# EAGLE design Adafruit 3.5 inch 480x320 Capacitive Touch Display (EAGLE 9.6.2)
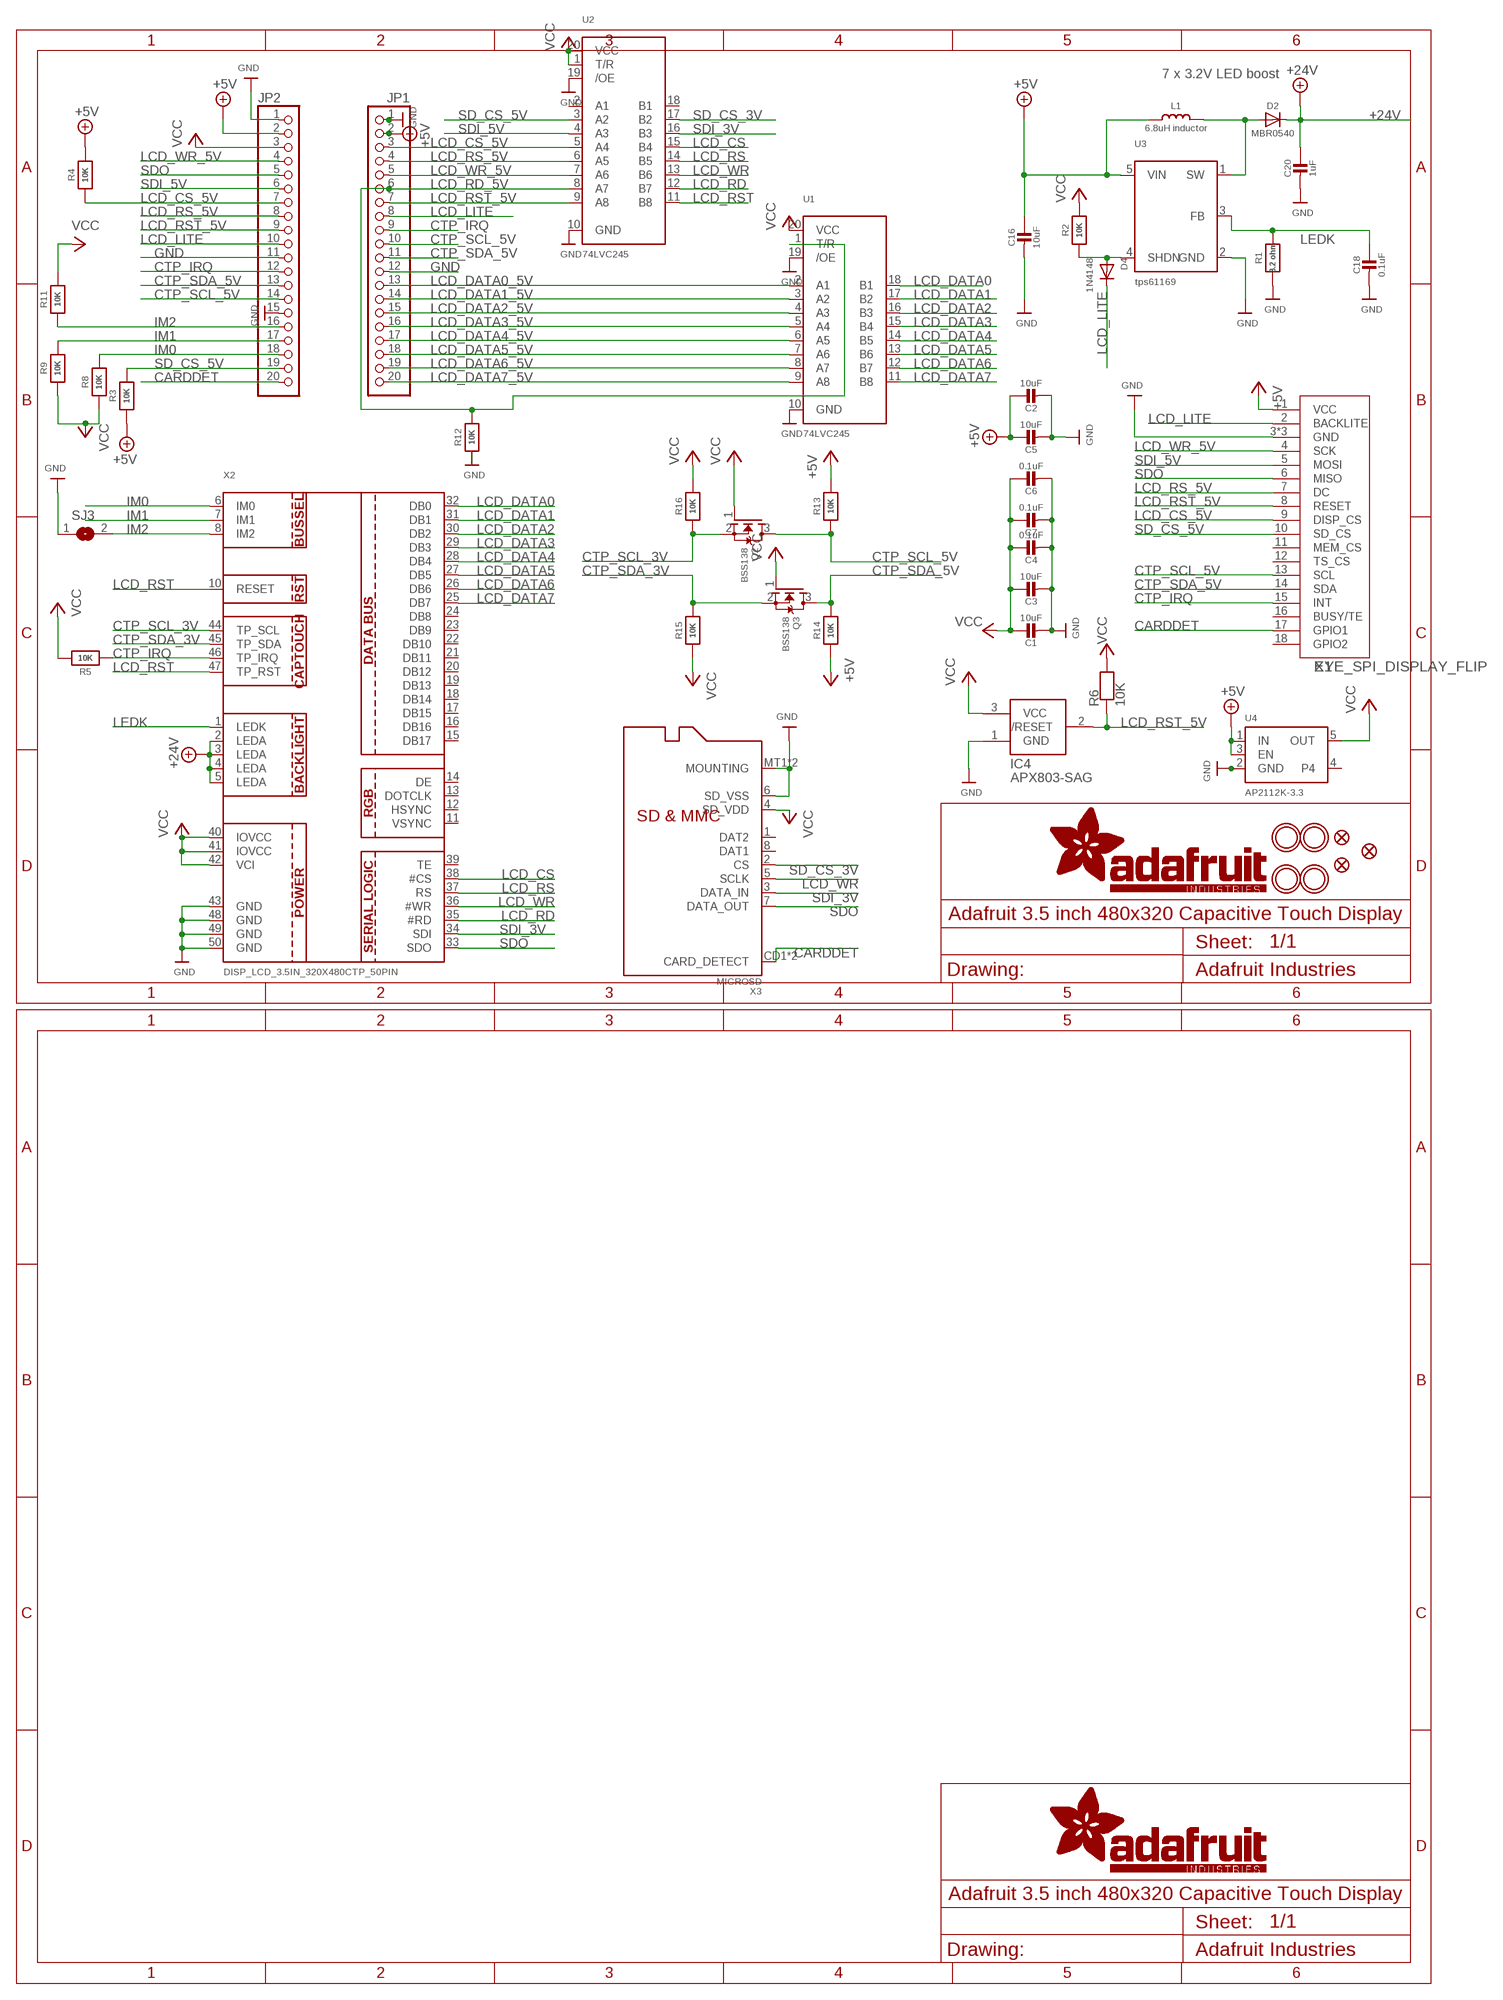
[diagram p0: schematic, sheet 1]

## Parts
C1  10uF  CAP_CERAMIC0805-NOOUTLINE  [0805-NO]
C2  10uF  CAP_CERAMIC0805-NOOUTLINE  [0805-NO]
C3  10uF  CAP_CERAMIC0805-NOOUTLINE  [0805-NO]
C4  0.1uF  CAP_CERAMIC0603_NO  [0603-NO]
C5  10uF  CAP_CERAMIC0805-NOOUTLINE  [0805-NO]
C6  0.1uF  CAP_CERAMIC0603_NO  [0603-NO]
C7  0.1uF  CAP_CERAMIC0603_NO  [0603-NO]
C16  10uF  CAP_CERAMIC0805-NOOUTLINE  [0805-NO]
C18  0.1uF  CAP_CERAMIC0603_NO  [0603-NO]
C20  1uF  CAP_CERAMIC0805-NOOUTLINE  [0805-NO]
D2  MBR0540  DIODESOD-123  [SOD-123]
D4  1N4148  DIODESOD-323F  [SOD-323F]
IC4  APX803-SAG  AXP083-SAG  [SOT23]
JP1  HEADER-1X20ROUND  [1X20_ROUND]
JP2  HEADER-1X20ROUND  [1X20_ROUND]
L1  6.8uH inductor  INDUCTORNR5040  [INDUCTOR_5X5MM_NR5040_NOTHERMALS]
Q2  BSS138  MOSFET-NWIDE  [SOT23-WIDE]
Q3  BSS138  MOSFET-NWIDE  [SOT23-WIDE]
R1  8.2 ohm  RESISTOR_0603_NOOUT  [0603-NO]
R2  10K  RESISTOR_0603_NOOUT  [0603-NO]
R3  10K  RESISTOR_0603_NOOUT  [0603-NO]
R4  10K  RESISTOR_0603_NOOUT  [0603-NO]
R5  10K  RESISTOR_0603_NOOUT  [0603-NO]
R6  10K  RESISTOR_0603_NOOUT  [0603-NO]
R8  10K  RESISTOR_0603_NOOUT  [0603-NO]
R9  10K  RESISTOR_0603_NOOUT  [0603-NO]
R11  10K  RESISTOR_0603_NOOUT  [0603-NO]
R12  10K  RESISTOR_0603_NOOUT  [0603-NO]
R13  10K  RESISTOR_0603_NOOUT  [0603-NO]
R14  10K  RESISTOR_0603_NOOUT  [0603-NO]
R15  10K  RESISTOR_0603_NOOUT  [0603-NO]
R16  10K  RESISTOR_0603_NOOUT  [0603-NO]
SJ3  SOLDERJUMPER  [SOLDERJUMPER_ARROW_NOPASTE]
U1  74LVC245  74LCX245_TSSOP20  [TSSOP20]
U2  74LVC245  74LCX245_TSSOP20  [TSSOP20]
U3  tps61169  VREG_BOOST_5PIN_SC70  [SC70-5]
U4  AP2112K-3.3  VREG_SOT23-5  [SOT23-5]
U$7  MOUNTINGHOLE3.0THIN  [MOUNTINGHOLE_3.0_PLATEDTHIN]
U$9  FIDUCIAL_1MM  [FIDUCIAL_1MM]
U$11  FIDUCIAL_1MM  [FIDUCIAL_1MM]
U$15  MOUNTINGHOLE3.0THIN  [MOUNTINGHOLE_3.0_PLATEDTHIN]
U$16  MOUNTINGHOLE3.0THIN  [MOUNTINGHOLE_3.0_PLATEDTHIN]
U$17  MOUNTINGHOLE3.0THIN  [MOUNTINGHOLE_3.0_PLATEDTHIN]
U$23  FIDUCIAL_1MM  [FIDUCIAL_1MM]
X1  EYE_SPI_DISPLAY_FLIP  [EYE_SPI_DISPLAY_BOTCONTACT]
X2  DISP_LCD_3.5IN_320X480CTP_50PIN  [TFT_3.5IN_320X480_50PIN]
X3  MICROSD  [MICROSD]

## Nets
+5V: C2.1 C5.1 C16.1 JP1.2 JP2.2 L1.P$1 R3.1 R4.2 R13.2 R14.1 U3.5(VIN) U4.1(IN) U4.3(EN) X1.1(VCC)
+24V: C20.1 D2.C X2.2(LEDA) X2.3(LEDA) X2.4(LEDA) X2.5(LEDA)
CARDDET: JP2.20 X1.17(GPIO1) X3.CD1(CARD_DETECT) X3.CD2(CARD_DETECT)
CTP_IRQ: JP1.9 JP2.12 R5.1 X1.15(INT) X2.46(TP_IRQ)
CTP_SCL_3V: Q2.2(S) R16.1 X2.44(TP_SCL)
CTP_SCL_5V: JP1.10 JP2.14 Q2.3(D) R13.1 X1.13(SCL)
CTP_SDA_3V: Q3.2(S) R15.2 X2.45(TP_SDA)
CTP_SDA_5V: JP1.11 JP2.13 Q3.3(D) R14.2 X1.14(SDA)
GND: C1.2 C2.2 C3.2 C4.2 C5.2 C6.2 C7.2 C16.2 C18.2 C20.2 IC4.1(GND) JP1.1 JP1.12 JP2.1 JP2.11 JP2.15 R1.1 R12.1 SJ3.1 U1.10(GND) U1.19(/OE) U2.10(GND) U2.19(/OE) U3.2(GND) U4.2(GND) X1.3(GND) X1.SUPPORT1(GND) X1.SUPPORT2(GND) X2.43(GND) X2.48(GND) X2.49(GND) X2.50(GND) X3.6(SD_VSS) X3.MT1(MOUNTING) X3.MT2(MOUNTING)
IM0: JP2.18 R8.2 X2.6(IM0)
IM1: JP2.17 R9.2 X2.7(IM1)
IM2: JP2.16 R11.1 SJ3.2 X2.8(IM2)
LCD_CS: U2.15(B4) X2.38(#CS)
LCD_CS_5V: JP1.3 JP2.7 R4.1 U2.5(A4) X1.9(DISP_CS)
LCD_DATA0: U1.18(B1) X2.32(DB0)
LCD_DATA0_5V: JP1.13 U1.2(A1)
LCD_DATA1: U1.17(B2) X2.31(DB1)
LCD_DATA1_5V: JP1.14 U1.3(A2)
LCD_DATA2: U1.16(B3) X2.30(DB2)
LCD_DATA2_5V: JP1.15 U1.4(A3)
LCD_DATA3: U1.15(B4) X2.29(DB3)
LCD_DATA3_5V: JP1.16 U1.5(A4)
LCD_DATA4: U1.14(B5) X2.28(DB4)
LCD_DATA4_5V: JP1.17 U1.6(A5)
LCD_DATA5: U1.13(B6) X2.27(DB5)
LCD_DATA5_5V: JP1.18 U1.7(A6)
LCD_DATA6: U1.12(B7) X2.26(DB6)
LCD_DATA6_5V: JP1.19 U1.8(A7)
LCD_DATA7: U1.11(B8) X2.25(DB7)
LCD_DATA7_5V: JP1.20 U1.9(A8)
LCD_LITE: D4.C JP1.8 JP2.10 X1.2(BACKLITE)
LCD_RD: U2.12(B7) X2.35(#RD)
LCD_RD_5V: JP1.6 R12.2 U1.1(T/R) U2.8(A7)
LCD_RS: U2.14(B5) X2.37(RS)
LCD_RS_5V: JP1.4 JP2.8 U2.6(A5) X1.7(DC)
LCD_RST: U2.11(B8) X2.10(RESET) X2.47(TP_RST)
LCD_RST_5V: IC4.2(/RESET) JP1.7 JP2.9 R6.1 U2.9(A8) X1.8(RESET)
LCD_WR: U2.13(B6) X2.36(#WR) X3.5(SCLK)
LCD_WR_5V: JP1.5 JP2.4 U2.7(A6) X1.4(SCK)
LEDK: C18.1 R1.2 U3.3(FB) X2.1(LEDK)
N$3: D2.A L1.P$2 U3.1(SW)
SD_CS_3V: U2.17(B2) X3.2(CS)
SD_CS_5V: JP2.19 R3.2 U2.3(A2) X1.10(SD_CS)
SDI_3V: U2.16(B3) X2.34(SDI) X3.3(DATA_IN)
SDI_5V: JP2.6 U2.4(A3) X1.5(MOSI)
SDO: JP2.5 X1.6(MISO) X2.33(SDO) X3.7(DATA_OUT)
SHDN: D4.A R2.1 U3.4(SHDN)
VCC: C1.1 C3.1 C4.1 C6.1 C7.1 IC4.3(VCC) JP2.3 Q2.1(G) Q3.1(G) R2.2 R5.2 R6.2 R8.1 R9.1 R11.2 R15.1 R16.2 U1.20(VCC) U2.1(T/R) U2.20(VCC) U4.5(OUT) X2.40(IOVCC) X2.41(IOVCC) X2.42(VCI) X3.4(SD_VDD)
Unconnected: U2.2(A1) U2.18(B1) U4.4 X1.11(MEM_CS) X1.12(TS_CS) X1.16(BUSY/TE) X1.18(GPIO2) X2.11(VSYNC) X2.12(HSYNC) X2.13(DOTCLK) X2.14(DE) X2.15(DB17) X2.16(DB16) X2.17(DB15) X2.18(DB14) X2.19(DB13) X2.20(DB12) X2.21(DB11) X2.22(DB10) X2.23(DB9) X2.24(DB8) X2.39(TE) X3.1(DAT2) X3.8(DAT1)

## Notes on the sheet
- 7 x 3.2V LED boost

## Library data of the parts
C1-C7 C16 C18 C20 = microbuilder:CAP_CERAMIC: Ceramic Capacitors For new designs, use the packages preceded by an '_' character since they are more reliable: The following footprints should be used on most boards: _0402 - Standard footprint for regular board layouts _0603 - Standard footprint for regular board layouts _0805 - Standard footprint for regular board layouts _1206 - Standard footprint for regular board layouts For extremely tight-pitch boards where space is at a premium, the following 'micro-pitch' footprints can be used (smaller pads, no silkscreen outline, etc.): _0402MP - Micro-pitch footprint for very dense/compact boards _0603MP - Micro-pitch footprint for very dense/compact boards _0805MP - Micro-pitch footprint for very dense/compact boards _1206MP - Micro-pitch footprint for very dense/compact boards
D2 = microbuilder:DIODE: Diode
D4 = adafruit:DIODE: Diode
IC4 = adafruit:AXP083
JP1 JP2 = microbuilder:HEADER-1X20
L1 = microbuilder:INDUCTOR: Inductors 0603: 10nH Ceramic Inductor - microwire antenna/RF (Digikey: 712-1434-2-ND) 0805: 560nH Ceramic Inductor - RF (Digikey: 553-1047-1-ND) 270nH Ceramic Inductor - Q = 40@250MHz, +-5%, 1 Ohm DC Resistance (Digikey: 535-10506-2-ND) 1007 (2518 Metric) SMT: 10µH 10% 250mOhm 820mA 1007 Inductor (Digikey: 587-2189-1-ND) 22µH 10% 500mOhm 580mA 1007 Inductor (Digikey: 587-2190-1-ND) 47µH 10% 950mOhm 420mA 1007 Inductor (Digikey: 587-2191-1-ND) 47µH 5% 100mOhm 1A 1008 Inductor (Digikey: 732-1816-1-ND) 5.0x5.0mm (Taiyo Yuden NR5040 Series) 6.8µH 20% 2.3A 64mOhm Inductor (Digikey: 587-2374-2-ND) 5.0x5.0mm (TDK VLC5045 Series) 4.7µH 20% 3.3A 34mOhm Inductor (Digikey: 445-6526-1-ND) 6.8µH 20% 2.7A 46mOhm Inductor (Digikey: 445-6527-1-ND) 6.0x6.0mm (TDK VLC6045 Series) 4.7µH 20% 3.8A 27mOhm Inductor (Digikey: 445-6538-2-ND) 6.8µH 20% 3A 41mOhm Inductor (Digikey: 445-6540-1-ND) 6.2µH 30% 2.2A 45mOhm Inductor (Digikey: SRR5028-6R2YCT-ND) - Not TDK VLC6045 but footprint should match 6.0x6.0mm (TDK SLF6045 Series) 6.8uH 30% 2A 33mOhm Inductor (Digikey: 445-4572-1-ND, Mouser: 810-SLF645T6R8N2R0PF) 6.0x6.0mm (Sumida CDRH5D28 Series) 6.2uH 30% 1.8A 45mOhm Inductor (Digikey: 308-1542-1-ND) Taiyo Yuden NR3015T2R2M - 2.2uH 20% 1.5A (Digikey: 587-1648-2-ND, Mouser: 963-NR3015T2R2M) - Used with TI TPS62172 CoilCraft RFID Transponder Coil - MA5532-AE (For use with AS3935 Lightning Sensor) Taiyo Yuden NRH2412T2R2MNGH - 2.2uH 20% 1AA (Digikey: 587-3443-1-ND) - Used with TI LM3671 Vishay IHLP 1.0uH Molded Inductor - 24mOhm DCR, 5A, +/-20%, -55°C-125°C (Digikey: 541-1319-1-ND)
Q2 Q3 = microbuilder:MOSFET-N: N-Channel Mosfet LEGEND VDS: Voltage Drain-Source ID: Drain Current RDS(ON): Drain-Source On-State Resistance VGS(TH): Gate-Source Threshold Voltage CISS: Drain-Source Input Capacitance SOT-23 Name VDS ID RDS(ON) VGS(TH) CISS Order Number 2N7002E 60V 260mA 2.5 Ohm 2.5V @ 250uA 26.7pF @ 25V 2N7002ET1GOSTR-ND BSH103 30V 850mA 400 mOhm 400mV @ 1mA 83pF @ 24V BSH103,235-ND BSS138 60V 320mA 1.6 Ohm 1.5V @ 250uA 50pF @ 10V Mouser: 771-BSS138PW115 DMN2075U-7 20V 4.2A 38 mOhm 1V @ 250 uA 594.3pF @ 10V DMN2075U-7DICT-ND * BSS138 good choice for I2C level-shifting POWERPAK 1212-8 Name VDS ID RDS(ON) VGS(TH) CISS Order Number Si7308DN 60V 6A 58 mOhm 3V @ 250uA 665pF @ 15V SI7308DN-T1-E3CT-ND
R1-R6 R8 R9 R11-R16 = microbuilder:RESISTOR: Resistors For new designs, use the packages preceded by an '_' character since they are more reliable: The following footprints should be used on most boards: _0402 - Standard footprint for regular board layouts _0603 - Standard footprint for regular board layouts _0805 - Standard footprint for regular board layouts _1206 - Standard footprint for regular board layouts For extremely tight-pitch boards where space is at a premium, the following 'micro-pitch' footprints can be used (smaller pads, no silkscreen outline, etc.): _0402MP - Micro-pitch footprint for very dense/compact boards _0603MP - Micro-pitch footprint for very dense/compact boards _0805MP - Micro-pitch footprint for very dense/compact boards _1206MP - Micro-pitch footprint for very dense/compact boards
SJ3 = microbuilder:SOLDERJUMPER: SMD Solder JUMPER Solder the two pads together to create a connection, or remove the solder to break it. REFLOW - Use this footprint for solder paste and reflow ovens. WAVE - Use this footprint for hand-soldering (larger pads). CLOSED - Has a trace between the two pads to ensure it is closed by default. The trace needs to be cut to disable the jumper, and can be closed again by creating a solder bridge between the two pads.; BOM: EXCLUDE
U1 U2 = microbuilder:74LCX245: 74LCX245MTC - 5.0V Tolerant Bi-Directional Buffer Can be used to interface 5.0V logic to 2.5 or 3.3V devices Digikey: 74LCX245MTCXTR-ND Mouser: 512-74LCX245MTCX
U3 = adafruit_power:VREG_BOOST_5PIN: FAN5331 - LED/OLED 20V Boost Converter Digikey: FAN5331SXCT-ND
U4 = adafruit_power:VREG_SOT23-5: SOT23-5 Fixed Voltage Regulators Part Current Out V Out V In V Dropout θJA (°C/W) TJ (°C) Digikey Part No. ADP121 150mA 3.3V 3.4-5.5V 0.09V @ 150mA -- -- ADP121-AUJZ33R7CT-ND ADP121 150mA 3.0V 3.1-5.5V 0.09V @ 150mA -- -- ADP121-AUJZ30R7CT-ND ADP122 300mA 3.3V 3.4-5.5V 0.085V @ 300mA -- -- ADP122AUJZ-3.3-R7CT-ND ADP1712 300mA 3.3V 3.5-5.5V 0.17V @ 300mA -- -- ADP1712AUJZ-3.3-R7TR-ND AP7311 (Low Cost) 150mA 3.3V 3.5-6V 0.15V @ 150mA -- -- AP7311-33WG-7DICT-ND LD39015M18R 150mA 1.8V 1.9V-5.5V 0.08V @ 100mA -- -- 497-6977-1-ND LP2985A-33DBVR 150mA 3.3V 3.3-16V 0.28V @ 150mA 206 150 296-18479-1-ND MCP1824T-3302E/OT 300mA 3.3V 3.5V-6V 0.2V @ 300mA -- -- MCP1824T-3302E/OTCT-ND MIC5205-2.5YM5 TR 150mA 2.5V 2.7-16V 0.165V @ 150mA -- -- 576-1257-2-ND MIC5205-3.0YM5 TR 150mA 3.0V 3.2V-16V 0.165V @ 150mA -- -- 576-1258-2-ND MIC5205-3.3YM5 TR 150mA 3.3V 3.5V-16V 0.165V @ 150mA -- -- 576-1259-2-ND TPS780330220 150mA 3.3V+2.2V 3.6-5.5V 250mV Max -- -- 296-23332-1-ND TDA3663/N1,135 100mA 3.3V 3.5-45V 0.18V @ 50mA -- -- 568-5343-1-ND Max operating temp can be calculated using θJA, TJ (max junction temperature), and power in watts. Set the "Maximum Ambient Temperature" until it reaches TJ ("Max Junction Temperature"), which is the absolute limit for safe use of the regulator: Heat Sink Temperature Calculator <http://www.daycounter.com/Calculators/Heat-Sink-Temperature-Calculator.phtml> For example, With 12V source into a 3.3V LP2985 and a 30mA load, we are dissipating (12V-3.3V) * 0.03A = 0.261W. With a θJA of 206 °C/W, a TJ of 150°C, and 261mW we can safely use the chip without a heat sink up to 75°C (=147.1°C Junction Temperature).; JLC_ROTATION: 270
U$7 U$15-U$17 = adafruit_electromech:MOUNTINGHOLE: Mounting Hole For #2 screws (0.086"/2.18mm width, 0.094"/2.4mm hole) use 2.5mm; BOM: EXCLUDE
U$9 U$11 U$23 = microbuilder:FIDUCIAL: Fiducial Alignment Points Various fiducial points for machine vision alignment.; BOM: EXCLUDE
X1 = adafruit_display:EYE_SPI_DISPLAY; LCSC: C2856802
X2 = adafruit_display:DISP_LCD_3.5IN_320X480CTP_50PIN
X3 = adafruit_electromech:MICROSD: MicroSD/Transflash Card Holder with SPI pinout 3M: 2908-05WB-MG 4UConnector: 19656 Footprint courtesy: Adafruit Industries; JLC_ROTATION: 90; LCSC: C125617

## Board
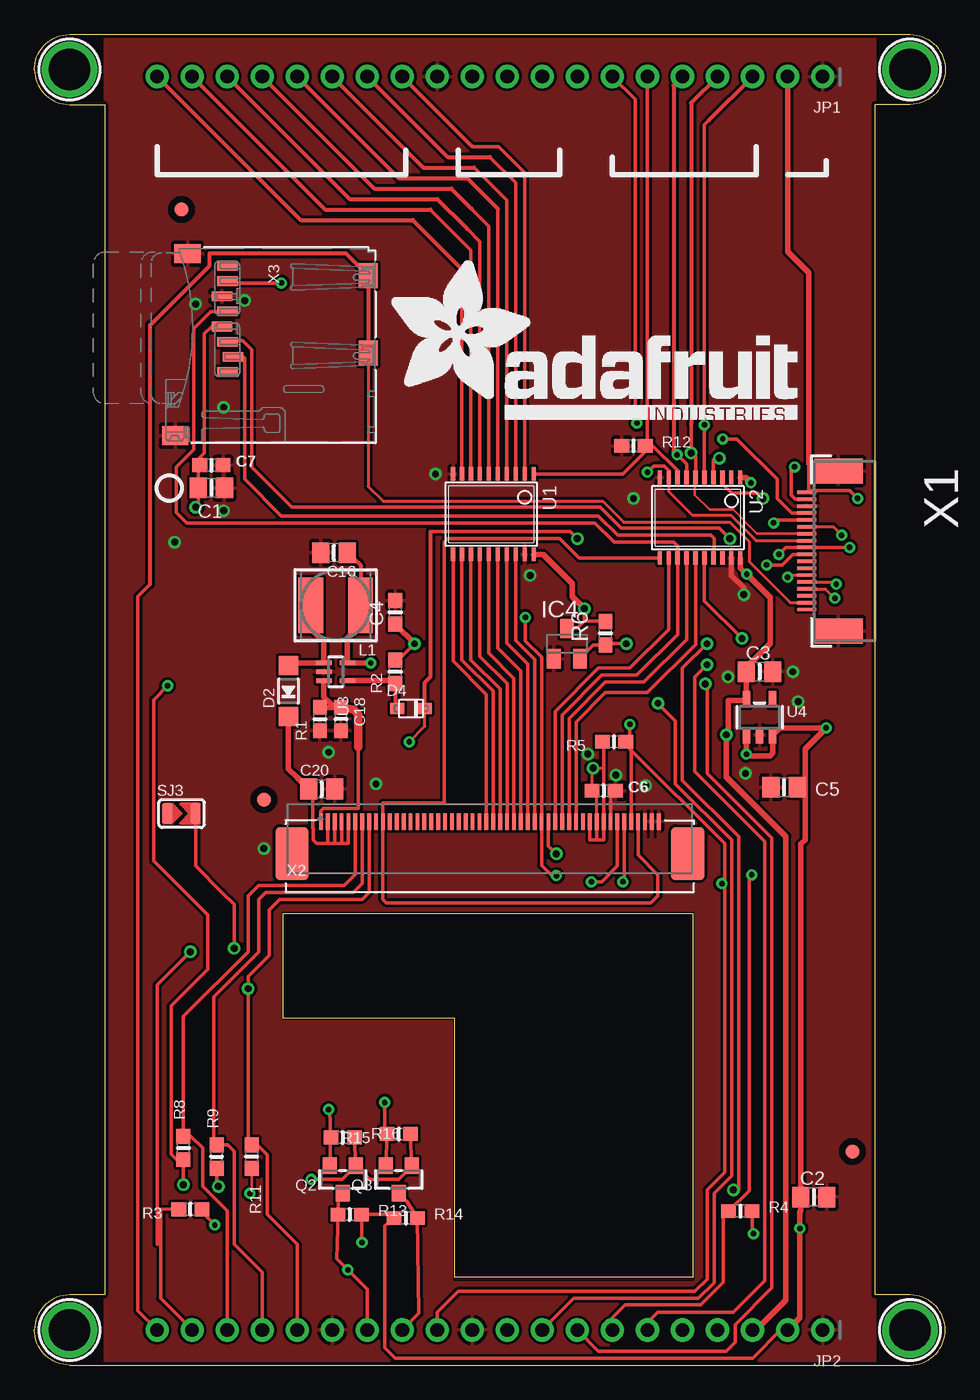
[diagram p1: board, top side]
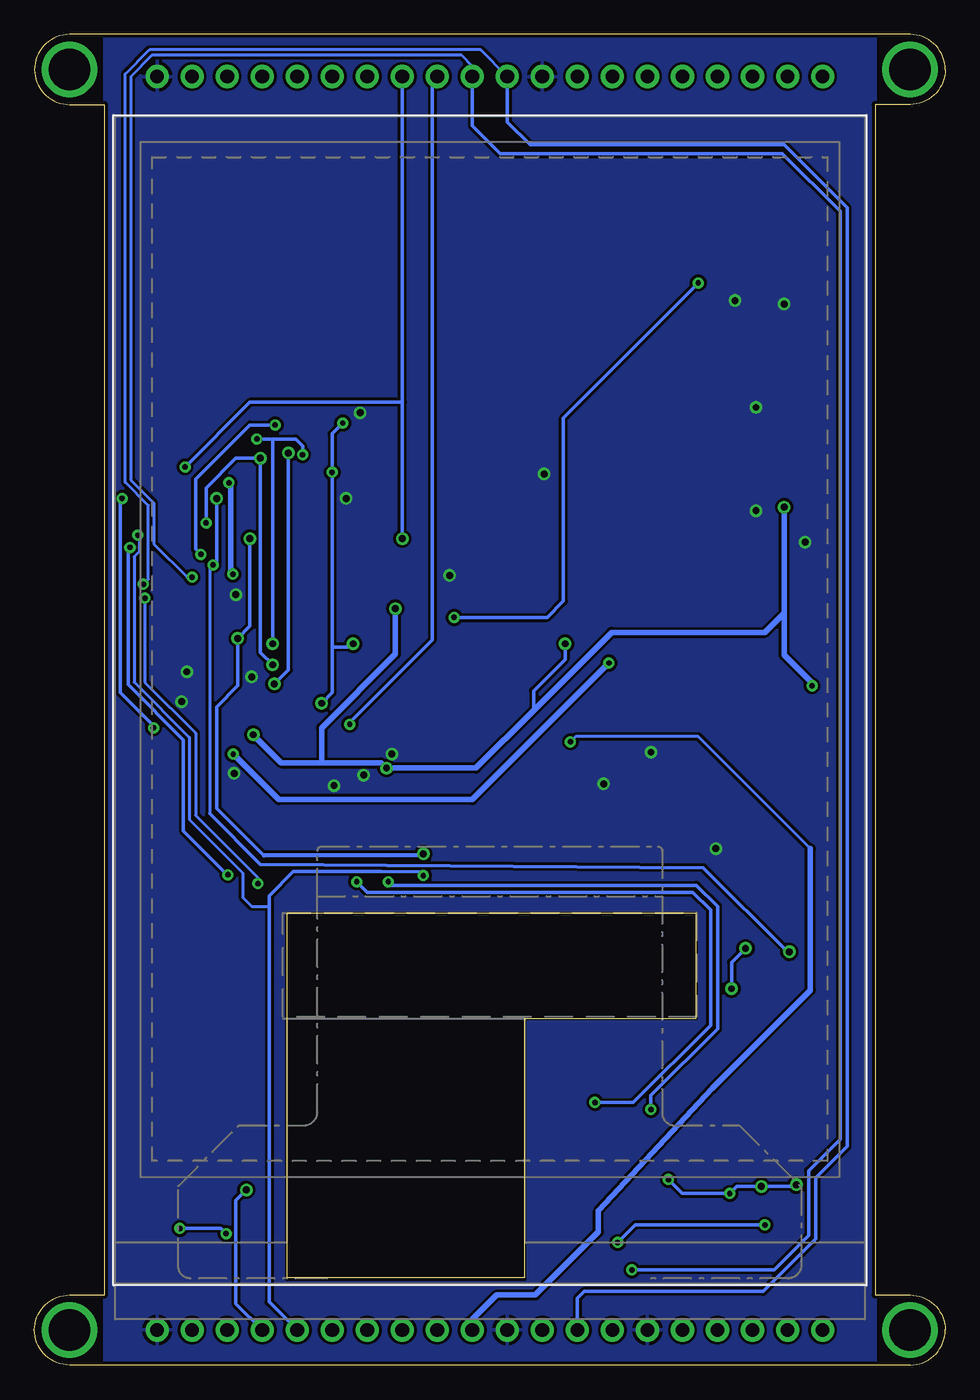
[diagram p2: board, bottom side, seen from below]

Size 66.04 x 96.52 mm. Coordinates in mm from the lower left corner, seen from the top.
Outline: 2.54,0 63.5,0 arc90 66.04,2.54 arc90 63.5,5.08 60.96,5.08 60.96,91.44 63.5,91.44 arc90 66.04,93.98 arc90 63.5,96.52 2.54,96.52 arc90 0,93.98 arc90 2.54,91.44 5.08,91.44 5.08,5.08 2.54,5.08 arc90 0,2.54 arc90 2.54,0
Copper layers (1*16): Top 0.035mm / dielectric 1.5mm / Bottom 0.035mm
Design rules "adafruit 7-7": minimum track width 7mil, minimum drill 15.5mil, track to track 8mil, track to pad 7mil, pad to pad 7mil, via to via 7mil, smd to smd 7mil, copper to edge 10mil, drill to drill 8mil, minimum pad ring 10mil, minimum via ring 8mil, stop-mask expansion 2mil, vias tented up to drill 20mil, thermal gap 10mil
tRestrict: area 44.5,38.2 to 44.6,38.6; area 45,38.2 to 45.1,38.6; area 18,6.2 to 47.8,32.8
bRestrict: area 18,6.2 to 47.8,32.8
Milling: 6 lines

### Footprints (pad centres in the part's own frame; a part is rotated, then mirrored left to right if it is on the bottom)
0805-NO = smd 1.24 x 1.5: 1 -0.95,0; 2 0.95,0
0603-NO = smd 1.075 x 1: 1 -0.85,0; 2 0.85,0
SOD-123 = smd 1.4 x 1.4: A 1.85,0; C -1.85,0
SOD-323F = smd 1 x 0.8: A -1,0; C 1,0
SOT23 = smd 1 x 1.4: 1 -0.95,-1.1; 2 0.95,-1.1; 3 0,1.1
1X20_ROUND = drill 1 pad 1.676: 1 -24.13,0; 2 -21.59,0; 3 -19.05,0; 4 -16.51,0; 5 -13.97,0; 6 -11.43,0; 7 -8.89,0; 8 -6.35,0; 9 -3.81,0; 10 -1.27,0; 11 1.27,0; 12 3.81,0; 13 6.35,0; 14 8.89,0; 15 11.43,0; 16 13.97,0; 17 16.51,0; 18 19.05,0; 19 21.59,0; 20 24.13,0
INDUCTOR_5X5MM_NR5040_NOTHERMALS = smd 1.8 x 4: P$1 -1.8,0; P$2 1.8,0
SOT23-WIDE = smd 1 x 1.2: 1 -0.95,-1; 2 0.95,-1; 3 0,1
SOLDERJUMPER_ARROW_NOPASTE = smd 0.762 x 1.524: 1 -1.016,0; 2 1.016,0
TSSOP20 = smd 0.305 x 0.991: 1 -2.925,-2.918; 2 -2.275,-2.918; 3 -1.625,-2.918; 4 -0.975,-2.918; 5 -0.325,-2.918; 6 0.325,-2.918; 7 0.975,-2.918; 8 1.625,-2.918; 9 2.275,-2.918; 10 2.925,-2.918; 11 2.925,2.918; 12 2.275,2.918; 13 1.625,2.918; 14 0.975,2.918; 15 0.325,2.918; 16 -0.325,2.918; 17 -0.975,2.918; 18 -1.625,2.918; 19 -2.275,2.918; 20 -2.925,2.918
SC70-5 = smd 0.35 x 1.15: 1 -0.65,-0.85; 2 0,-0.85; 3 0.65,-0.85; 4 0.65,0.85; 5 -0.65,0.85
SOT23-5 = smd 0.55 x 1.2: 1 -0.95,-1.3; 2 0,-1.3; 3 0.95,-1.3; 4 0.95,1.3; 5 -0.95,1.3
MOUNTINGHOLE_3.0_PLATEDTHIN = drill 3 pad 3.6: P$1 0,0
FIDUCIAL_1MM = smd 1 x 1: 1 0,0
EYE_SPI_DISPLAY_BOTCONTACT = smd 0.25 x 1.4: 1 4.25,1.154; 2 3.75,1.154; 3 3.25,1.154; 4 2.75,1.154; 5 2.25,1.154; 6 1.75,1.154; 7 1.25,1.154; 8 0.75,1.154; 9 0.25,1.154; 10 -0.25,1.154; 11 -0.75,1.154; 12 -1.25,1.154; 13 -1.75,1.154; 14 -2.25,1.154; 15 -2.75,1.154; 16 -3.25,1.154; 17 -3.75,1.154; 18 -4.25,1.154 | smd 1.8 x 3.5: SUPPORT1 -5.8,-1.152; SUPPORT2 5.8,-1.152
TFT_3.5IN_320X480_50PIN = smd 0.275 x 1.2 bottom: 1 12.25,1.066; 2 11.75,1.066; 3 11.25,1.066; 4 10.75,1.066; 5 10.25,1.066; 6 9.75,1.066; 7 9.25,1.066; 8 8.75,1.066; 9 8.25,1.066; 10 7.75,1.066; 11 7.25,1.066; 12 6.75,1.066; 13 6.25,1.066; 14 5.75,1.066; 15 5.25,1.066; 16 4.75,1.066; 17 4.25,1.066; 18 3.75,1.066; 19 3.25,1.066; 20 2.75,1.066; 21 2.25,1.066; 22 1.75,1.066; 23 1.25,1.066; 24 0.75,1.066; 25 0.25,1.066; 26 -0.25,1.066; 27 -0.75,1.066; 28 -1.25,1.066; 29 -1.75,1.066; 30 -2.25,1.066; 31 -2.75,1.066; 32 -3.25,1.066; 33 -3.75,1.066; 34 -4.25,1.066; 35 -4.75,1.066; 36 -5.25,1.066; 37 -5.75,1.066; 38 -6.25,1.066; 39 -6.75,1.066; 40 -7.25,1.066; 41 -7.75,1.066; 42 -8.25,1.066; 43 -8.75,1.066; 44 -9.25,1.066; 45 -9.75,1.066; 46 -10.25,1.066; 47 -10.75,1.066; 48 -11.25,1.066; 49 -11.75,1.066; 50 -12.25,1.066 | smd 2.4 x 3.81 bottom: PAD1 14.35,-1.253; PAD2 -14.35,-1.253
MICROSD = smd 0.7 x 1.5: 1 1.761,-3.147; 2 0.661,-2.747; 3 -0.439,-3.147; 4 -1.539,-3.547; 5 -2.639,-3.147; 6 -3.739,-3.547; 7 -4.839,-3.147; 8 -5.939,-3.147 | smd 1.8 x 1.4: CD1 -5.239,7.053; CD2 0.38,7.053 | smd 1.4 x 1.9: MT1 -6.839,-6.047; MT2 6.361,-6.947

### Placement (x,y rotation side)
C1  12.83,63.63 0 top
C2  56.52,12.19 0 top
C3  52.58,50.29 0 top
C4  26.16,54.61 90 top
C5  54.36,41.91 180 top
C6  41.28,41.66 0 top
C7  12.83,65.28 0 top
C16  21.72,58.93 180 top
C18  22.23,46.86 270 top
C20  20.83,41.78 0 top
D2  18.42,48.89 90 top
D4  27.31,47.62 0 top
IC4  38.61,52.32 0 top
JP1  33.02,93.47 180 top
JP2  33.02,2.54 180 top
L1  21.84,55.12 180 top
PLABEL0  [PLABEL0]  6.35,34.16 90 top
PLABEL1  [PLABEL1]  19.18,23.5 0 top
PLABEL2  [PLABEL2]  18.8,20.45 0 top
PLABEL3  [PLABEL3]  44.83,78.1 0 top
PLABEL4  [PLABEL4]  9.4,90.17 90 top
PLABEL5  [PLABEL5]  11.94,90.17 90 top
PLABEL6  [PLABEL6]  14.48,90.17 90 top
PLABEL7  [PLABEL7]  17.02,90.17 90 top
PLABEL8  [PLABEL8]  19.56,90.17 90 top
PLABEL9  [PLABEL9]  22.1,90.17 90 top
PLABEL10  [PLABEL10]  24.64,90.17 90 top
PLABEL11  [PLABEL11]  27.18,90.17 90 top
PLABEL12  [PLABEL12]  29.72,88.39 90 top
PLABEL13  [PLABEL13]  34.29,88.9 90 top
PLABEL14  [PLABEL14]  34.93,89.28 90 top
PLABEL15  [PLABEL15]  37.47,89.28 90 top
PLABEL16  [PLABEL16]  39.88,86.11 90 top
PLABEL17  [PLABEL17]  42.55,89.41 90 top
PLABEL18  [PLABEL18]  45.09,89.92 90 top
PLABEL19  [PLABEL19]  47.62,89.66 90 top
PLABEL20  [PLABEL20]  50.17,89.15 90 top
PLABEL21  [PLABEL21]  52.7,90.17 90 top
PLABEL22  [PLABEL22]  55.25,88.52 90 top
PLABEL23  [PLABEL23]  57.79,88.39 90 top
PLABEL24  [PLABEL24]  44.96,80.26 0 top
PLABEL25  [PLABEL25]  32.51,84.96 0 top
PLABEL26  [PLABEL26]  47.24,85.09 0 top
PLABEL27  [PLABEL27]  56.26,84.58 0 top
PLABEL28  [PLABEL28]  47.12,83.06 0 top
PLABEL29  [PLABEL29]  18.8,84.71 0 top
PLABEL30  [PLABEL30]  9.4,3.81 90 top
PLABEL31  [PLABEL31]  11.94,3.81 90 top
PLABEL32  [PLABEL32]  14.48,3.81 90 top
PLABEL33  [PLABEL33]  17.02,3.81 90 top
PLABEL34  [PLABEL34]  19.56,3.81 90 top
PLABEL35  [PLABEL35]  22.1,3.81 90 top
PLABEL36  [PLABEL36]  24.64,3.81 90 top
PLABEL37  [PLABEL37]  27.18,3.81 90 top
PLABEL38  [PLABEL38]  29.72,3.81 90 top
PLABEL39  [PLABEL39]  29.72,0.25 0 top
PLABEL40  [PLABEL40]  32.89,3.68 0 top
PLABEL41  [PLABEL41]  35.31,0.38 0 top
PLABEL42  [PLABEL42]  37.85,3.81 0 top
PLABEL43  [PLABEL43]  40.77,0.25 0 top
PLABEL44  [PLABEL44]  42.29,3.81 0 top
PLABEL45  [PLABEL45]  44.96,0.25 0 top
PLABEL46  [PLABEL46]  50.17,3.56 90 top
PLABEL47  [PLABEL47]  52.58,3.68 90 top
PLABEL48  [PLABEL48]  55.12,3.68 90 top
PLABEL49  [PLABEL49]  57.66,3.68 90 top
PLABEL50  [PLABEL50]  13.34,40.13 90 top
PLABEL51  [PLABEL51]  20.19,8.38 0 top
PLABEL52  [PLABEL52]  10.92,34.8 90 top
PLABEL53  [PLABEL53]  55.63,26.04 90 top
PLABEL54  [PLABEL54]  11.43,92.2 0 bottom
PLABEL55  [PLABEL55]  13.97,92.2 0 bottom
PLABEL56  [PLABEL56]  16.51,92.2 0 bottom
PLABEL57  [PLABEL57]  19.05,92.2 0 bottom
PLABEL58  [PLABEL58]  8.89,92.2 0 bottom
PLABEL59  [PLABEL59]  21.59,92.2 0 bottom
PLABEL60  [PLABEL60]  24.13,92.2 0 bottom
PLABEL61  [PLABEL61]  26.67,92.2 0 bottom
PLABEL62  [PLABEL62]  29.21,96.01 0 bottom
PLABEL63  [PLABEL63]  31.75,92.2 0 bottom
PLABEL64  [PLABEL64]  33.78,96.01 0 bottom
PLABEL65  [PLABEL65]  36.83,92.2 0 bottom
PLABEL66  [PLABEL66]  39.24,95.88 0 bottom
PLABEL67  [PLABEL67]  41.91,92.2 0 bottom
PLABEL68  [PLABEL68]  44.45,95.88 0 bottom
PLABEL69  [PLABEL69]  46.99,92.2 0 bottom
PLABEL70  [PLABEL70]  49.53,95.88 0 bottom
PLABEL71  [PLABEL71]  52.07,92.2 0 bottom
PLABEL72  [PLABEL72]  54.74,95.88 0 bottom
PLABEL73  [PLABEL73]  57.15,92.33 0 bottom
PLABEL74  [PLABEL74]  8.76,4.83 0 bottom
PLABEL75  [PLABEL75]  11.43,0.25 0 bottom
PLABEL76  [PLABEL76]  13.97,3.68 0 bottom
PLABEL77  [PLABEL77]  16.51,0.25 0 bottom
PLABEL78  [PLABEL78]  19.05,3.68 0 bottom
PLABEL79  [PLABEL79]  21.59,0.25 0 bottom
PLABEL80  [PLABEL80]  24.13,3.68 0 bottom
PLABEL81  [PLABEL81]  26.67,-1.78 0 bottom
PLABEL82  [PLABEL82]  29.21,3.68 0 bottom
PLABEL83  [PLABEL83]  31.75,0.25 0 bottom
PLABEL84  [PLABEL84]  34.29,3.68 0 bottom
PLABEL85  [PLABEL85]  36.83,0.25 0 bottom
PLABEL86  [PLABEL86]  39.37,3.56 0 bottom
PLABEL87  [PLABEL87]  41.91,0.25 0 bottom
PLABEL88  [PLABEL88]  44.45,3.68 0 bottom
PLABEL89  [PLABEL89]  46.99,0.25 0 bottom
PLABEL90  [PLABEL90]  49.53,3.68 0 bottom
PLABEL91  [PLABEL91]  52.07,0.25 0 bottom
PLABEL92  [PLABEL92]  54.61,3.68 0 bottom
PLABEL93  [PLABEL93]  57.15,0.25 0 bottom
Q2  22.35,13.46 180 top
Q3  26.42,13.46 180 top
R1  20.7,46.86 90 top
R2  26.16,50.29 90 top
R3  11.3,11.3 180 top
R4  51.18,11.18 0 top
R5  42.04,45.21 180 top
R6  41.4,53.09 90 top
R8  10.8,15.75 90 top
R9  13.21,15.11 90 top
R11  15.75,15.11 270 top
R12  43.43,66.67 0 top
R13  22.86,10.92 0 top
R14  26.92,10.67 0 top
R15  26.42,16.76 180 top
R16  22.35,16.51 0 top
SJ3  10.67,40.01 0 top
U1  33.27,61.72 180 top
U2  48.26,61.47 180 top
U3  21.84,50.29 270 top
U4  52.58,46.99 0 top
U$7  2.54,2.54 0 top
U$9  59.31,15.49 0 top
U$11  10.67,83.82 0 top
U$15  63.5,2.54 0 top
U$16  2.54,93.98 0 top
U$17  63.5,93.98 0 top
U$19  [ADAFRUIT_TEXT_30MM]  25.65,68.58 0 top
U$23  16.64,41.02 0 top
U$31  [PCBFEAT-REV-040]  9.78,63.63 90 top
X1  57.15,59.05 90 top
X2  33.02,38.35 0 bottom
X3  17.15,73.79 270 top

### Tracks (layer width: path | path; a pad name or v marks a point on that pad's centre or on a via)
+5V  (via drill 0.39)
  Top 0.254: JP2.2 54.1,2.54 52.07,0.51 26.16,0.51 25.4,1.27 25.4,10.09 R14.1 25.82,10.92 R13.2 23.75,10.86 v23.75,8.89 | R4.2 52.03,9.63 v52.14,9.52 | v13.07,10.16 12.15,11.08 R3.1 | v59.69,62.86 59.12,63.43 56.12,63.43 X1.1 56.13,63.44 56.13,65.41
  Top 0.305: C16.1 23.64,58.02 L1.P$1
  Top 0.406: JP1.2 54.61,80.77 56.13,79.25 56.13,65.41 | 55.88,41.91 55.88,38.1 55.57,37.78 C2.1 55.57,11.18 55.5,11.11 v55.5,9.91 55.5,3.43 JP2.2 | 55.88,41.91 55.88,44.7 v57.4,46.23 54.07,46.23 U4.3 | C5.1 55.88,41.91 | L1.P$1 23.64,53.67 22.69,52.72 U3.5 24.37,50.94 v24.38,50.93 | U4.1 v51.63,44.32 51.63,44.2 53.34,44.2 53.53,44.38 U4.3 | U4.3
  Bottom 0.254: v52.14,9.52 52.52,9.91 v55.5,9.91 | v13.07,10.16 22.48,10.16 v23.75,8.89 | v59.69,62.86 59.82,62.74 59.82,48.77 57.4,46.35 v57.4,46.23
  Bottom 0.406: v24.38,50.93 34.29,41.02 48.33,41.02 v51.63,44.32
+24V
  Top 0.254: X2.2 21.27,37.85 | X2.3 21.77,37.85 | 21.77,37.85 21.27,37.85 | X2.4 22.27,37.85 | 22.27,37.85 21.77,37.85 | X2.5 22.77,37.85 22.27,37.85 | 21.27,37.85 20.45,37.85 20.2,38.1 20.2,38.97 20.19,38.97 20.19,41.47 C20.1
  Top 0.406: C20.1 19.05,42.61 18.42,43.25 D2.C
CARDDET
  Top 0.203: X3.CD2 24.2,63.74 25.27,62.66 41.2,62.66 42.72,61.14 50.43,61.14 51.82,59.75 51.82,58.29 54.8,55.3 X1.17
  Top 0.254: JP2.20 7.49,3.94 7.49,55.75 8.38,56.64
  Top 0.305: 8.38,56.64 8.38,75.44 12.7,79.76 12.7,80.65 22.58,80.65 X3.CD1 X3.CD2
CTP_IRQ  (via drill 0.39)
  Top 0.203: X1.15 57.36,56.3 v58.04,55.63 | v49.84,34.92 50.04,35.12 50.04,35.43
  Top 0.254: X2.46 43.27,45.12 43.18,45.21 | v43.18,46.48 43.18,45.21 | 43.18,45.21 43.18,44.7 50.04,37.85 50.04,35.43 50.04,13.97 48.77,12.7 48.77,6.22 47.88,5.33 30.73,5.33 29.21,3.81 JP2.12 | R5.1 43.18,45.21
  Bottom 0.203: v58.04,55.63 58.04,49.52 54.36,45.83 54.36,39.88 49.84,35.36 v49.84,34.92
  Bottom 0.254: v43.18,46.48 43.18,46.61 37.21,52.58 37.21,93.09 JP1.9
CTP_SCL_3V  (via drill 0.39)
  Top 0.254: Q2.2 R16.1 21.4,18.48 v21.34,18.54 | v40.39,35.05 41.13,35.05 42.27,36.2 X2.44
  Bottom 0.254: v21.34,18.54 21.34,19.56 16.51,24.38 16.51,33.27 18.03,34.8 40.13,34.8 v40.39,35.05
CTP_SCL_5V  (via drill 0.39)
  Top 0.203: v54.61,57.15 54.61,57.3 X1.13
  Top 0.254: Q2.3 22.03,12.01 R13.1 21.9,7.71 v22.72,6.9 24.13,5.49 JP2.14
  Bottom 0.203: JP1.10 34.29,94.23 35.05,95 57.53,95 59.06,93.47 59.06,64.2 57.38,62.52 57.38,59.56 54.97,57.15 v54.61,57.15
  Bottom 0.254: JP1.10 34.29,89.92 32.26,87.88 11.81,87.88 7.62,83.69 7.62,16.38 9.91,14.1 9.91,9.4 12.41,6.9 v22.72,6.9
CTP_SDA_3V  (via drill 0.39)
  Top 0.254: Q3.2 R15.2 25.4,16.83 v25.4,19.05 | v42.67,35.05 42.77,35.15 X2.45
  Bottom 0.254: v25.4,19.05 22.61,19.05 17.02,24.64 17.02,33.02 18.29,34.29 41.91,34.29 v42.67,35.05
CTP_SDA_5V  (via drill 0.39)
  Top 0.203: X1.14 57.98,56.8 v58.14,56.64
  Top 0.254: Q3.3 26.99,11.89 R14.2 27.87,3.74 JP2.13
  Bottom 0.203: JP1.11 33.68,95.4 57.7,95.4 59.46,93.64 59.46,64.03 57.79,62.36 57.79,57 v58.14,56.64
  Bottom 0.254: JP1.11 31.75,90.17 30.1,88.52 11.68,88.52 7.11,83.95 7.11,15.88 9.4,13.59 9.4,9.14 13.21,5.33 26.16,5.33 26.67,4.83 JP2.13
GND  (via drill 0.5)
  Top 0.254: X2.43 41.77,41.3 C6.2
  Top 0.406: U2.19 50.54,57.29 51.44,56.39 v51.44,55.88
  other vias: 35.94,57.28 40.13,44.32 44.32,42.04 51.56,42.93 55.37,48.13 16.64,37.47 10.16,59.69 21.34,44.45 24.77,42.16 13.72,69.47 42.16,42.8 11.68,76.96 15.24,77.22 13.72,61.98 29.08,64.64 43.43,62.86 42.42,69.09 54.99,50.29 50.29,49.91
  pour Top: 5.08,96.52 5.08,0 60.96,0 60.96,96.52
  pour Bottom: 5.08,96.52 5.08,0 60.96,0 60.96,96.52
IM0
  Top 0.254: X2.6 23.27,35.59 22.48,34.8 16.26,34.8 15.49,34.04 15.49,29.97 10.8,25.27 R8.2 11.34,16.6 12.19,15.75 12.19,12.95 13.97,11.18 JP2.18
IM1
  Top 0.203: R9.2 13,16.17 13,16.27
  Top 0.254: X2.7 23.77,34.95 23.11,34.29 16.76,34.29 16.26,33.78 16.26,29.97 13,26.72 13,16.27 | R9.2 14.01,15.96 14.48,15.49 14.48,8.76 16.51,6.73 JP2.17
IM2  (via drill 0.5)
  Top 0.203: R11.1 15.49,16.22 15.49,16.32
  Top 0.254: SJ3.2 11.68,36.2 13.59,34.29 14.48,33.4 v14.48,30.23 | X2.8 24.27,34.29 23.76,33.78 17.78,33.78 17.02,33.02 17.02,29.72 15.49,28.19 v15.49,27.3 15.49,16.32 | R11.1 16.17,15.96 16.89,15.24 16.89,10.92 19.05,8.76 JP2.16
  Bottom 0.254: v14.48,30.23 15.49,29.21 v15.49,27.3
LCD_CS
  Top 0.254: X2.38 39.27,46.64 41.4,48.77 44.45,48.77 47.94,52.25 U2.15
LCD_CS_5V  (via drill 0.39)
  Top 0.254: U2.5 v48.59,68.2 48.59,89.99 48.9,90.3 | JP2.7 41.91,3.43 42.85,4.37 48.32,4.37 49.95,6 49.95,10.8 R4.1 50.35,11.18 51.82,12.64 51.82,35.36 v52.01,35.56 | v59.11,59.31 v59.11,59.3 X1.9 54.48,59.3 v53.98,58.8
  Top 0.305: 48.9,90.3 JP1.3
  Bottom 0.254: v59.11,59.31 59.11,59.08 59.25,58.94 59.25,49.36 55.25,45.35 55.25,38.73 52.07,35.56 v52.01,35.56 | v53.98,58.8 54.36,59.18 54.36,64.26 50.42,68.2 v48.59,68.2
LCD_DATA0
  Top 0.254: X2.32 36.27,51.18 34.9,52.55 U1.18
LCD_DATA0_5V
  Top 0.254: U1.2 35.55,86.5 33.66,88.39 31.75,88.39
  Top 0.305: 31.75,88.39 JP1.13
LCD_DATA1
  Top 0.254: X2.31 35.77,50.84 34.25,52.37 U1.17
LCD_DATA1_5V
  Top 0.254: U1.3 34.9,85.75 33.02,87.63
  Top 0.305: JP1.14 29.97,87.63 33.02,87.63
LCD_DATA2
  Top 0.254: X2.30 35.27,50.33 33.6,52 U1.16
LCD_DATA2_5V
  Top 0.254: 31.88,86.87 34.25,84.5 U1.4
  Top 0.305: JP1.15 28.19,86.87 31.88,86.87
LCD_DATA3
  Top 0.254: X2.29 34.77,49.81 32.95,51.63 U1.15
LCD_DATA3_5V
  Top 0.254: U1.5 33.6,83.88
  Top 0.305: JP1.16 26.42,86.11 31.37,86.11 33.6,83.88
LCD_DATA4
  Top 0.254: X2.28 34.27,49.42 32.3,51.39 U1.14
LCD_DATA4_5V
  Top 0.254: U1.6 32.95,82.62 31.69,83.88
  Top 0.305: JP1.17 24.64,85.34 30.23,85.34 31.69,83.88
LCD_DATA5
  Top 0.254: X2.27 33.77,49.03 31.65,51.16 U1.13
LCD_DATA5_5V
  Top 0.254: U1.7 32.3,81.49 31.37,82.42
  Top 0.305: JP1.18 22.86,84.58 29.21,84.58 31.37,82.42
LCD_DATA6
  Top 0.254: X2.26 33.27,48.89 31,51.16 U1.12
LCD_DATA6_5V
  Top 0.254: U1.8 31.65,80.87 28.7,83.82
  Top 0.305: JP1.19 21.08,83.82 28.7,83.82
LCD_DATA7
  Top 0.254: X2.25 32.77,48.64 30.35,51.06 U1.11
LCD_DATA7_5V
  Top 0.254: U1.9 31,79.49
  Top 0.305: JP1.20 19.3,83.06 27.43,83.06 31,79.49
LCD_LITE  (via drill 0.39, 0.5)
  Top 0.203: v27.18,45.21 28.31,46.34 D4.C
  Top 0.254: 28.7,60.45 38.86,60.45 v39.37,59.94 | X1.2 55.18,62.8 54.86,63.12 54.86,64.9 v55.12,65.15
  Top 0.305: 28.7,60.45 28.7,49.91 28.31,49.51 D4.C
  Bottom 0.203: 9.78,37.47 17.91,45.59 26.8,45.59 v27.18,45.21
  Bottom 0.254: v39.37,59.94 39.37,69.85 | 39.37,69.85 JP1.8 | 39.37,69.85 50.42,69.85 v55.12,65.15
  Bottom 0.406: JP2.10 34.29,3.3 32.51,5.08 29.72,5.08 25.15,9.65 25.15,11.18 16.89,20.07 9.78,27.18 9.78,37.47
LCD_RD
  Top 0.254: X2.35 37.77,47.42 40.89,50.55 43.18,50.55 45.98,53.35 U2.12
LCD_RD_5V
  Top 0.254: U2.8 46.64,64.87 44.83,66.67 44.45,66.67 | 44.45,66.67 R12.2 | JP1.6 44.45,66.67 | U1.1 42.67,64.64 44.45,66.42 44.45,66.67
LCD_RS
  Top 0.254: X2.37 38.77,46.9 41.4,49.53 44.2,49.53 47.29,52.62 U2.14
LCD_RS_5V  (via drill 0.5)
  Top 0.178: X1.7 52.39,60.3 50.66,62.04 48.96,62.04 47.88,63.12 47.88,64.33 U2.6
  Top 0.254: v48.64,49.4 48.77,49.28 48.77,42.93 53.47,38.23 53.47,5.59 50.8,2.92 50.8,1.65 50.17,1.02 40.89,1.02 JP2.8 | 47.62,68.28 v47.62,66.17 47.94,65.86 U2.6
  Top 0.305: JP1.4 47.62,91.57 47.62,68.28
  Bottom 0.254: v48.64,49.4 47.62,50.42 v47.62,66.17
LCD_RST
  Top 0.254: X2.47 43.77,37 45.21,35.56 45.21,34.04 44.7,33.53 25.52,33.53 25.27,33.78 X2.10 25.27,40.77 29.72,40.77 29.72,59.69 29.97,59.94 38.1,59.94 39.49,58.55 U2.11
LCD_RST_5V  (via drill 0.39, 0.5)
  Top 0.203: U2.9 45.98,63.36 47.7,61.65 50.5,61.65 52.34,59.8 X1.8
  Top 0.254: v45.21,48.01 46.48,46.74 46.48,42.16 50.55,38.1 50.55,13.72 49.28,12.45 49.28,5.97 48.13,4.83 39.12,4.83 JP2.9 | U2.9 45.98,64.87 45.65,65.21 44.89,65.21 v44.45,64.77 | v43.69,68.33 43.56,68.33 43.56,91.82 JP1.7 | IC4.2 39.56,51.26 40.53,52.24 R6.1 41.49,52.32 v42.93,52.32
  Bottom 0.254: v45.21,48.01 44.45,48.77 44.45,52.07 | 44.45,52.07 v44.45,64.77 44.45,67.56 v43.69,68.33 | v42.93,52.32 43.18,52.07 44.45,52.07
LCD_WR
  Top 0.254: X2.36 38.27,47.16 41.15,50.04 43.69,50.04 46.64,52.98 U2.13 46.64,59.41 46.36,59.69 42.04,59.69 40.64,61.09 11.05,61.09 10.29,61.85 10.29,65.15 11.56,66.42 11.56,75.18 12.8,76.43 X3.5
LCD_WR_5V  (via drill 0.39, 0.5)
  Top 0.254: v48.77,52.32 46.99,50.55 46.99,42.42 51.05,38.35 51.05,12.7 v50.67,12.7 | v46.59,66.04 47.29,65.35 U2.7 | v49.91,67.18 50.93,67.18 53.85,64.26 53.85,62.86 54.91,61.8 X1.4
  Top 0.305: JP1.5 46.36,92.84 46.36,66.28 v46.59,66.04
  Bottom 0.254: v48.77,52.32 48.77,67.06 | 48.77,67.06 48.77,67.18 47.1,67.18 46.59,66.67 v46.59,66.04 | v50.67,12.7 51.44,11.94 51.44,4.45 JP2.4 | 48.77,67.06 48.9,67.18 v49.91,67.18
LEDK
  Top 0.254: X2.1 20.77,40.18 20.75,40.18 20.96,40.39 23.5,40.39 23.5,44.83
  Top 0.406: C18.1 R1.2 | U3.3 20.99,48.48 21.59,47.88 22.23,47.88
  Top 0.61: 22.23,47.88 C18.1 23.14,47.55 23.5,47.19 23.5,44.83
N$3
  Top 0.406: L1.P$2 20.04,53.42 20.99,52.47 U3.1 18.42,50.94 D2.A
SD_CS_3V
  Top 0.254: U2.17 49.28,58.59 49.28,59.94 49.02,60.2 42.29,60.2 40.89,61.59 17.91,61.59 15.24,64.26 15.24,73.03 15.11,73.15 14.42,73.15 X3.2
SD_CS_5V  (via drill 0.39, 0.5)
  Top 0.203: R3.2 9.14,11.3 | 9.14,8.76 8.89,8.76
  Top 0.254: 9.14,11.3 9.14,8.76 9.14,4.83 JP2.19 | 8.89,8.76 8.89,27.56 v11.3,29.97 | v52.83,62.86 52.45,63.25 50.55,63.25 49.89,63.91 U2.3 | X1.10 54.98,58.8 54.21,58.04 v53.09,58.04
  Bottom 0.203: v53.09,58.04 53.34,58.04 53.34,40.01
  Bottom 0.254: v52.83,62.86 52.83,58.29 v53.09,58.04 | 53.34,40.01 49.66,36.32 17.53,36.07 11.43,29.97 v11.3,29.97
SDI_3V  (via drill 0.5)
  Top 0.254: v50.42,59.94 49.66,60.71 42.55,60.71 41.02,62.23 18.67,62.23 15.75,65.15 15.75,73.66 15.11,74.3 14.07,74.3 X3.3 | X2.34 37.27,37.66 v37.85,37.08 | v51.31,52.7 48.59,55.43 U2.16
  Bottom 0.254: 49.4,36.96 52.83,40.39 52.83,47.75 51.31,49.28 v51.31,52.7 50.42,53.59 v50.42,59.94 | 37.97,36.96 v37.85,37.08
  Bottom 0.305: 37.97,36.96 49.4,36.96
SDI_5V  (via drill 0.39, 0.5)
  Top 0.254: v48.77,50.8 47.88,49.91 47.88,43.05 52.96,37.97 52.96,6.1 50.67,3.81 45.21,3.81 44.45,3.05 JP2.6 | U2.4 49.23,65.66 49.37,65.79 v49.66,65.79 | X1.5 53.81,61.3 v53.59,61.09
  Bottom 0.254: v48.77,50.8 49.66,51.69 v49.66,65.79 51.44,65.79 53.59,63.63 v53.59,61.09
SDO  (via drill 0.39)
  Top 0.203: X1.6 57.93,60.8 v58.53,60.2
  Top 0.254: v35.6,54.23 35.6,52.53 36.77,51.37 X2.33 36.77,36.26 37.52,35.5 v37.85,35.5 | v17.91,78.49 14.14,78.49 X3.7
  Bottom 0.203: v58.53,60.2 58.43,60.1 58.43,59.03 58.82,58.64 58.82,49.54 54.81,45.53 54.81,39.57 50.93,35.69 50.93,33.91 50.29,33.27 49.02,33.27
  Bottom 0.254: v35.6,54.23 28.87,54.23 27.69,55.42 27.69,68.71 v17.91,78.49 | JP2.5 49.02,4.57 49.02,33.27 49.02,34.04 47.26,35.8 40.89,35.8 38.12,35.77 v37.85,35.5
SHDN
  Top 0.305: R2.1 26.16,47.77 D4.A
  Top 0.406: U3.4 26.16,49.64 R2.1
VCC  (via drill 0.39, 0.5)
  Top 0.178: R11.2 15.75,12.57 v15.62,12.45
  Top 0.203: X2.41 40.77,41.31 | C6.1 40.43,43.22 v40.51,43.31 41.27,43.31
  Top 0.254: X3.4 12.84,75.33 12.32,74.8 12.32,66.17 11.88,65.72 11.88,65.28 | v11.68,62.23 11.88,62.42 C1.1 11.88,65.28 | v27.56,52.32 26.54,51.31 26.23,51.31 R2.2 | v10.8,13.08 10.8,14.35 11.18,14.73 10.86,14.73 R8.1 10.31,14.9 9.91,15.3 9.91,26.04 12.57,28.7 12.57,32.64 8.64,36.58 8.64,48.26 v9.65,49.28 | v13.34,12.95 13.21,13.08 R9.1 | X2.40 40.27,38.1 40.77,38.1 | X2.41 40.77,38.1 | 40.77,38.1 41.27,38.1 X2.42 41.27,43.31 41.27,45.13 R5.2 | v39.88,54.86 39.88,53.98 | 39.88,53.98 39.37,53.47 38.65,53.47 IC4.3 | 39.88,53.98 41.34,53.98 R6.2 | Q2.1 R16.2 | Q2.1 24.3,13.46 26.42,13.46 27.37,14.41 Q3.1 R15.1 | Q2.1 22.3,13.46 v20.07,13.46 | 40.77,41.31 C6.1 | C7.1 11.88,65.28
  Top 0.406: JP2.3 52.32,2.54 54.48,4.7 54.48,38.35 50.17,42.67 v50.17,45.72 50.29,45.82 50.29,48.19 51.53,48.19 U4.5 C3.1 51.58,50.34 51.58,50.56 53.34,52.32 53.34,55.68 v51.65,57.37 51.19,57.83 U2.20 | v39.88,54.86 38.99,55.75 38.99,56.69 36.88,58.8 U1.20 | U2.1 51.57,64.39 v51.94,64.01 | C4.1 26.16,53.72 v27.56,52.32
  Bottom 0.203: 45.34,43.69 45.21,43.69
  Bottom 0.254: 29.85,47.5 29.85,48.89 27.56,51.18 v27.56,52.32 | v10.8,13.08 10.92,12.95 v13.34,12.95 15.11,12.95 v15.62,12.45 19.05,12.45 v20.07,13.46
  Bottom 0.406: v39.88,54.86 39.88,51.56 45.21,46.23 45.21,43.69 40.89,43.69 v40.51,43.31 34.04,43.31 29.85,47.5 24.19,53.15 13.08,53.15 11.68,54.55 | v50.17,45.72 48.13,43.69 45.34,43.69 | v51.94,64.01 51.82,63.88 51.82,57.53 v51.65,57.37 | 11.68,54.55 11.68,51.5 9.65,49.47 v9.65,49.28 | 11.68,54.55 v11.68,62.23

### Text on the board
Pinguin_tBackup: D7 | D6 | D5 | D4 | D3 | D2 | D1 | D0 | GND | SDA | SCL | IRQ | Backlite | RST | RD | WR | C/D | CS | 3-5V | GND | LCD Data I/O | Touchscreen | LCD control | PWR | Inputs | Bi-directional | 8-bit 8080-type parallel | 3.5" 480x320 TFT LCD Breakout Board w/Capacitive Touch | IM2 | Close IM2 / for 8-Bit | HX8357D / +FT5336 | Power with 3.3V-5V | Logic at 3.3V-5V | SPI Interface | Lite | D/C | MOSI | Card Detect | Card CS | IM0 | IM1 | IM2 | GND | SCL | SDA | IRQ | CLK | 3.3V out | 3-5V | GND | GND | RST | CS | MISO
Pinguin_bBackup: GND | SCL | Lite | RD | C/D | Vin | D7 | D6 | D5 | D4 | D3 | D2 | D1 | D0 | SDA | IRQ | RST | WR | CS | GND | CD | IM0 | IM2 | SCL | IRQ | Lite | MOSI | CLK | D/C | Vin | CCS | IM1 | GND | SDA | GND | RST | CS | MISO | 3Vo | GND